# Altium project RadCounterX4.PrjPcb
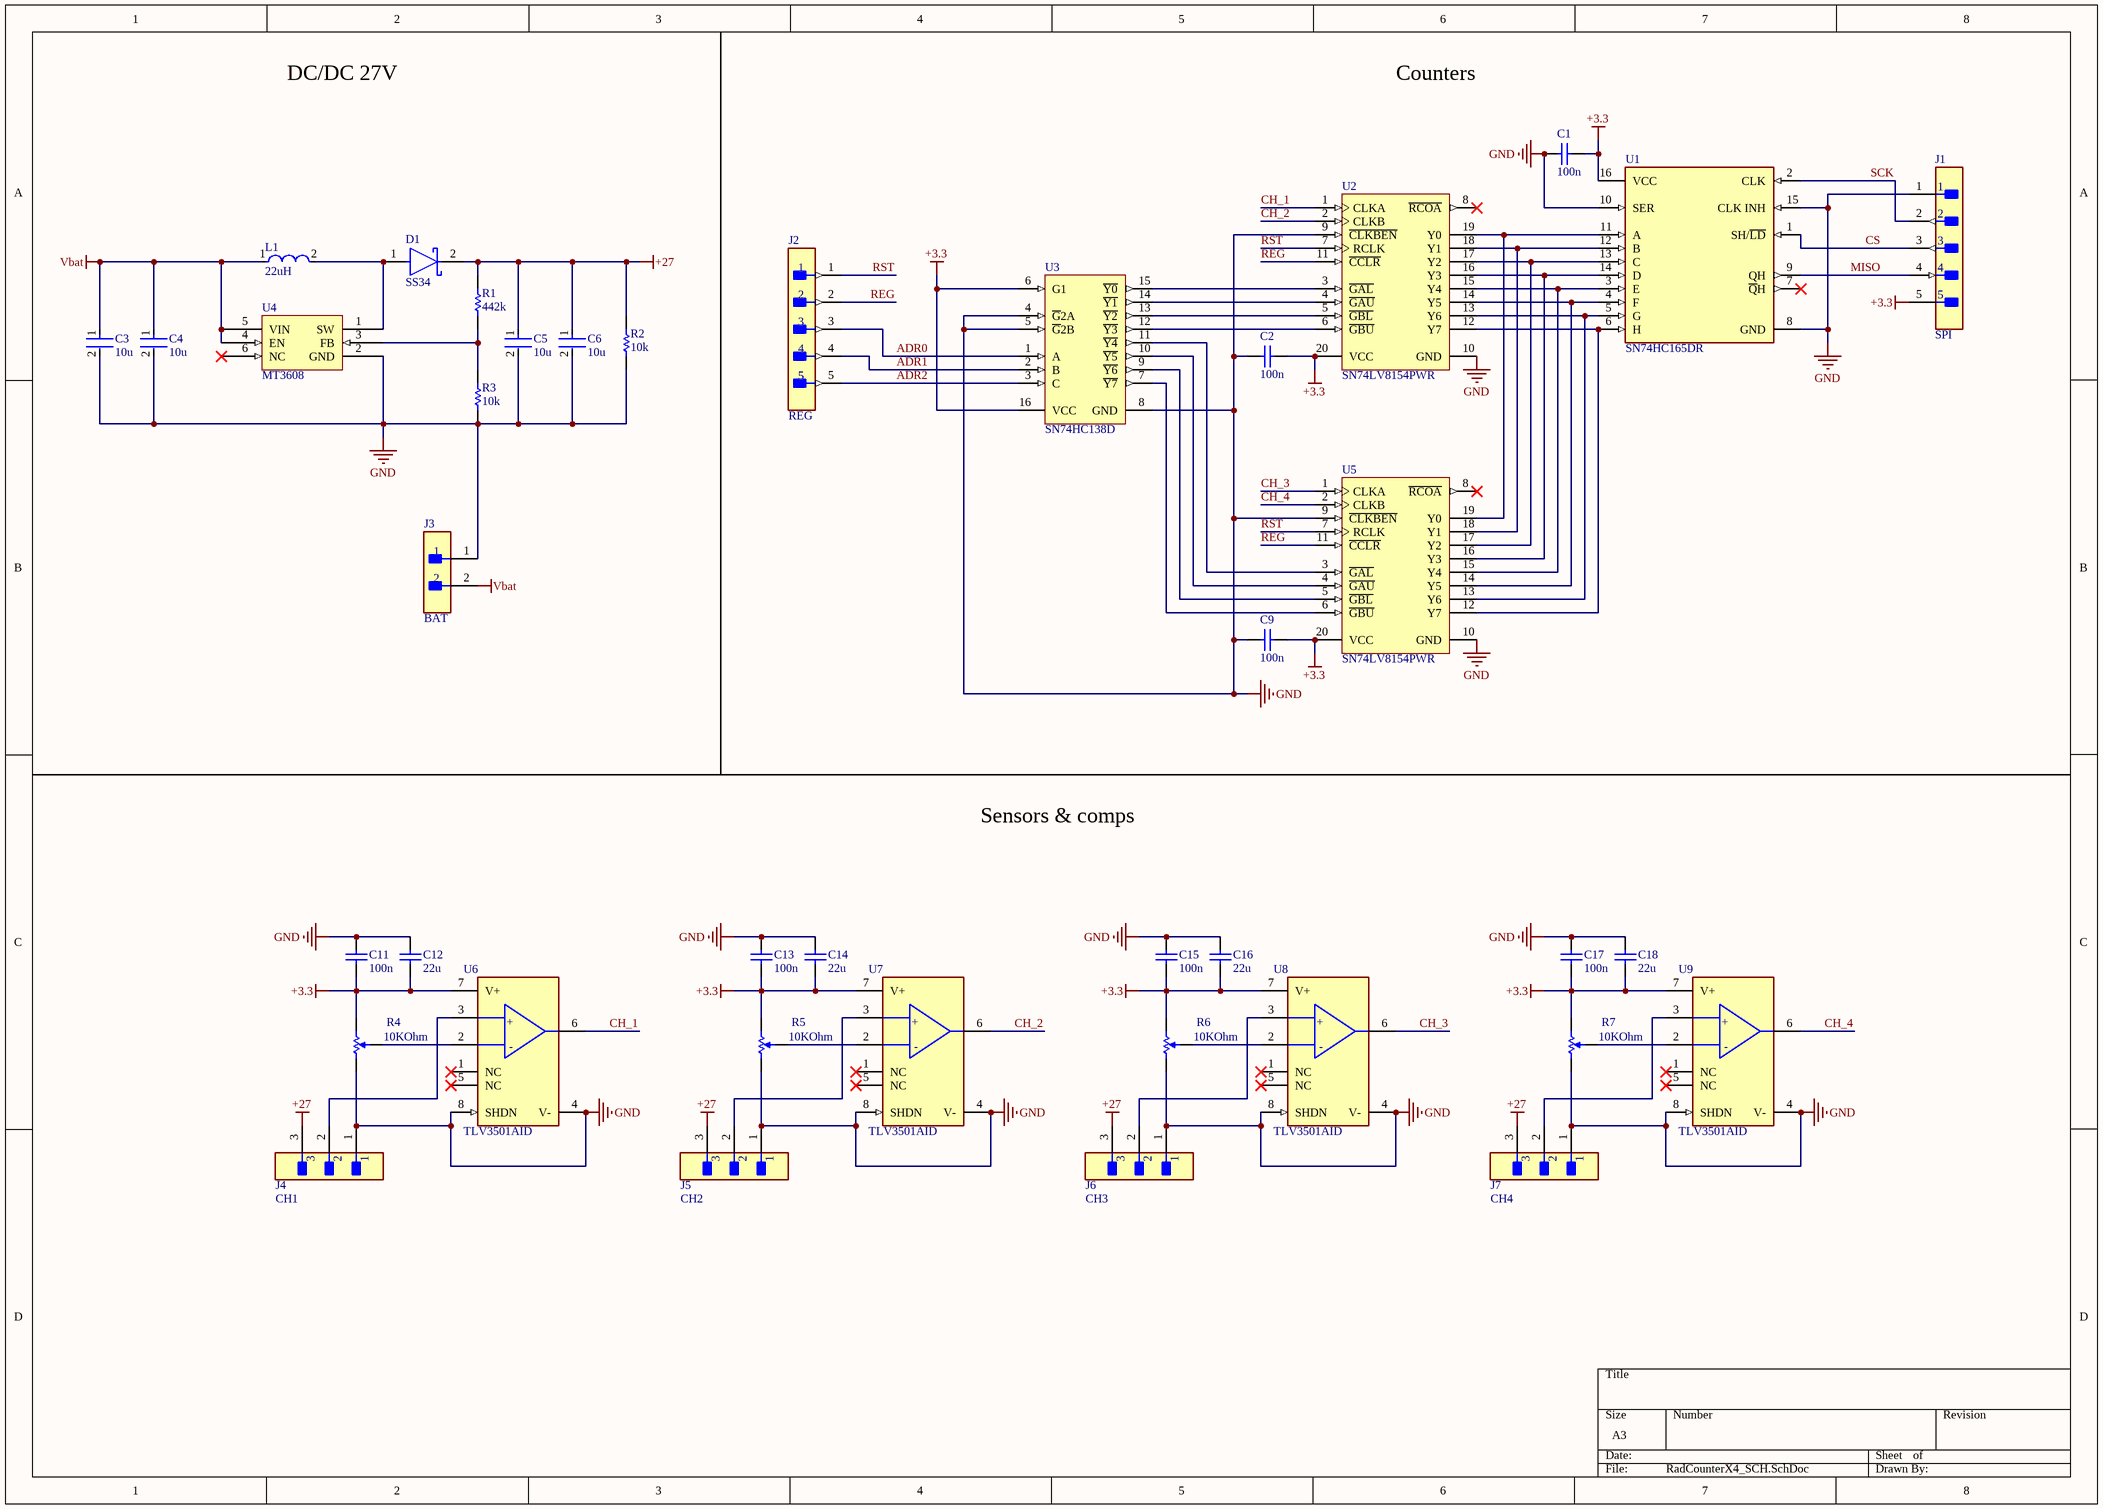
[diagram p0: RadCounterX4_SCH.SchDoc]
1 sheet, 40 parts. Net scope: global (net labels, ports and power ports of the same name join across sheets).
Board file: RadCounterX4_PCB.PcbDoc

## Sheet RadCounterX4_SCH.SchDoc: RadCounterX4
size A3; Author: Nate Hunter; DrawnBy: Nate Hunter; Revision: 1.0; SheetNumber: 1; SheetTotal: 1

### Parts
C1  100n  [C0603]
C2  100n  [C0402]
C3  10u  [FP-GRM32-MFG]
C4  10u  [FP-GRM32-MFG]
C5  10u  [FP-GRM32-MFG]
C6  10u  [FP-GRM32-MFG]
C9  100n  [C0402]
C11  100n  [C0603]
C12  22u  [C0603]
C13  100n  [C0603]
C14  22u  [C0603]
C15  100n  [C0603]
C16  22u  [C0603]
C17  100n  [C0603]
C18  22u  [C0603]
D1  SS34  [FP-403AE-MFG]
J1  SPI  [FP-B5B-XH-AM_LF_SN-MFG]
J2  REG  [FP-B5B-XH-AM_LF_SN-MFG]
J3  BAT  [FP-B2B-XH-A_LF_SN-MFG]
J4  CH1  [FP-B3B-XH-A_LF_SN-MFG]
J5  CH2  [FP-B3B-XH-A_LF_SN-MFG]
J6  CH3  [FP-B3B-XH-A_LF_SN-MFG]
J7  CH4  [FP-B3B-XH-A_LF_SN-MFG]
L1  22uH  [FP-IHLP-2525CZ-FP_2_413x3-MFG]
R1  442k  [R0603]
R2  10k  [R0603]
R3  10k  [R0603]
R4  Resistance: 10KOhm  [BOUR-TC33X-2_V]  (hidden comment: TC33X-2-103E)
R5  Resistance: 10KOhm  [BOUR-TC33X-2_V]  (hidden comment: TC33X-2-103E)
R6  Resistance: 10KOhm  [BOUR-TC33X-2_V]  (hidden comment: TC33X-2-103E)
R7  Resistance: 10KOhm  [BOUR-TC33X-2_V]  (hidden comment: TC33X-2-103E)
U1  SN74HC165DR  [FP-D0016A-MFG]
U2  SN74LV8154PWR  [PW0020A_N]
U3  SN74HC138D  [D0016A_N]
U4  MT3608  [SOT23]
U5  SN74LV8154PWR  [PW0020A_N]
U6  TLV3501AID  [FP-D0008A-IPC_C]
U7  TLV3501AID  [FP-D0008A-IPC_C]
U8  TLV3501AID  [FP-D0008A-IPC_C]
U9  TLV3501AID  [FP-D0008A-IPC_C]

### Nets
+3.3: C1.2 C2.2 C9.2 C11.1 C12.1 C13.1 C14.1 C15.1 C16.1 C17.1 C18.1 J1.5 R4.3 R5.3 R6.3 R7.3 U1.16(VCC) U2.20(VCC) U3.6(G1) U3.16(VCC) U5.20(VCC) U6.7(V+) U7.7(V+) U8.7(V+) U9.7(V+)
+27: C5.1 C6.1 D1.2(C) J4.3 J5.3 J6.3 J7.3 R1.1 R2.2
GND: C1.1 C2.1 C3.2 C4.2 C5.2 C6.2 C9.1 C11.2 C12.2 C13.2 C14.2 C15.2 C16.2 C17.2 C18.2 J1.1 J3.1 J4.1 J5.1 J6.1 J7.1 R2.1 R3.1 R4.1 R5.1 R6.1 R7.1 U1.8(GND) U1.10(SER) U1.15(CLK_INH) U2.9(~{CLKBEN}) U2.10(GND) U3.4(~{G}2A) U3.5(~{G}2B) U3.8(GND) U4.2(GND) U5.9(~{CLKBEN}) U5.10(GND) U6.4(V-) U6.8(SHDN) U7.4(V-) U7.8(SHDN) U8.4(V-) U8.8(SHDN) U9.4(V-) U9.8(SHDN)
Vbat: C3.1 C4.1 J3.2 L1.1 U4.4(EN) U4.5(VIN)
ADR0: J2.3 U3.1(A)
ADR1: J2.4 U3.2(B)
ADR2: J2.5 U3.3(C)
CH_1: U2.1(CLKA) U6.6(OUT)
CH_2: U2.2(CLKB) U7.6(OUT)
CH_3: U5.1(CLKA) U8.6(OUT)
CH_4: U5.2(CLKB) U9.6(OUT)
CS: J1.3 U1.1(SH/~{LD})
MISO: J1.4 U1.9(QH)
REG: J2.2 U2.11(~{CCLR}) U5.11(~{CCLR})
RST: J2.1 U2.7(RCLK) U5.7(RCLK)
SCK: J1.2 U1.2(CLK)
NetD1_1: D1.1(A) L1.2 U4.1(SW)
NetJ4_2: J4.2 U6.3(+IN)
NetJ5_2: J5.2 U7.3(+IN)
NetJ6_2: J6.2 U8.3(+IN)
NetJ7_2: J7.2 U9.3(+IN)
NetR1_2: R1.2 R3.2 U4.3(FB)
NetR4_2: R4.2 U6.2(-IN)
NetR5_2: R5.2 U7.2(-IN)
NetR6_2: R6.2 U8.2(-IN)
NetR7_2: R7.2 U9.2(-IN)
NetU1_3: U1.3(E) U2.15(Y4) U5.15(Y4)
NetU1_4: U1.4(F) U2.14(Y5) U5.14(Y5)
NetU1_5: U1.5(G) U2.13(Y6) U5.13(Y6)
NetU1_6: U1.6(H) U2.12(Y7) U5.12(Y7)
NetU1_11: U1.11(A) U2.19(Y0) U5.19(Y0)
NetU1_12: U1.12(B) U2.18(Y1) U5.18(Y1)
NetU1_13: U1.13(C) U2.17(Y2) U5.17(Y2)
NetU1_14: U1.14(D) U2.16(Y3) U5.16(Y3)
NetU2_3: U2.3(~{GAL}) U3.15(~{Y0})
NetU2_4: U2.4(~{GAU}) U3.14(~{Y1})
NetU2_5: U2.5(~{GBL}) U3.13(~{Y2})
NetU2_6: U2.6(~{GBU}) U3.12(~{Y3})
NetU3_7: U3.7(~{Y7}) U5.6(~{GBU})
NetU3_9: U3.9(~{Y6}) U5.5(~{GBL})
NetU3_10: U3.10(~{Y5}) U5.4(~{GAU})
NetU3_11: U3.11(~{Y4}) U5.3(~{GAL})

Not connected (* = marked no-connect by the designer): U1 7(~{Q}H)*; U2 8(~{RCOA})*; U4 6(NC)*; U5 8(~{RCOA})*; U6 1(NC)* 5(NC)*; U7 1(NC)* 5(NC)*; U8 1(NC)* 5(NC)*; U9 1(NC)* 5(NC)*

### Notes on the sheet
- DC/DC 27V
- Counters
- Sensors & comps
- (in symbol CMP-04896-000133-1) +; -

### Library data of the parts
C1 C2 C9 C11-C18 = Capacitor: Generic SMD Capacitor
  C1 C2 C9 C11 C13 C15 C17: Value: 100n
  C12 C14 C16 C18: Value: 22u
C3-C6 = CMP-2000-05261-2: CAP CER 10UF 50V X7R 1210; Manufacturer Part Number: GRM32ER71H106KA12L; Manufacturer: Murata; Tolerance: 10%; Material: Ceramic; Temperature Coefficient: 15%; Voltage Rating: 50V; Temperature Characteristic: X7R; Value: 10uF; ComponentLink2Description: Datasheet; Device Class L1: Passive Components; Lead Free: Yes; Temperature Range High: +125°C; Category: Cap; ComponentLink2URL: https://search.murata.co.jp/Ceramy/image/img/A01X/G101/ENG/GRM32ER71H106KA12-01.pdf; Device Class L2: Capacitors; Package: GRM32; Mouser Description: 1210 10 uF 50 V ±10% Tolerance X7R SMT Multilayer Ceramic Capacitor; Capacitance: 10uF; Octopart: https://octopart.com/grm32er71h106ka12l-murata-10470987; Digikey Description: CAP CER 10UF 50V X7R 1210; Height: 2.7mm; Temperature: -55°C to +125°C; Temperature Range Low: -55°C; RoHS: TRUE; Device Class L3: Ceramic Capacitors; Automotive: No
D1 = CMP-2000-04943-2: DIODE SCHOTTKY 40V 1A SMA; Manufacturer: ON Semiconductor; Peak Reverse Current: 0.2mA; Max Junction Temp: +125°C; Standoff Height: 0.05mm; Max Surge Forward Current: 40A; Mouser Description: Schottky Diodes & Rectifiers SMA 40V 1.0A; RoHS: TRUE; Lead Free: Yes; Manufacturer Part Number: SS34; Device Class L3: Schottky Diodes; Category: Diode; Automotive: No; Digikey Description: DIODE SCHOTTKY 40V 1A SMA; ComponentLink2Description: Datasheet; Device Class L2: Diodes; Height: 2.5mm; Temperature Range High: +125°C; ComponentLink2URL: https://www.onsemi.com/pub/Collateral/SS19-D.PDF; Device Class L1: Discrete Semiconductors; Package: 403AE; Octopart: https://octopart.com/ss14-on+semiconductor-29205033; Max Repetitive Reverse Voltage: 40V; Temperature Range Low: -65°C; Forward Current: 1A; Temperature: -65°C to +125°C
J1 J2 = CMP-17439-000304-1: CONN HEADER VERT 5POS 2.5MM; Mated Stacking Heights: 9.8mm; Voltage Rating: 250V; Max Current Rating: 3A; Number of Positions: 5; Contact Resistance: 20mR; Depth: 5.75mm; Connector Type: Header; Color: Green; Insulation Material: Nylon; Contact Plating: Copper; Length: 14.9mm; Fastening Type: Detent; Contact Material: Brass; Number of Rows: 1; Contact Type: Male Pin; Housing Material: Polyamide; Housing Color: White; Lead Free: Lead Free; Max Voltage Rating (AC): 250V; Mount: Through Hole; Contact Shape: Square; Min Operating Temperature: -25°C; Packaging: Bulk; Orientation: Straight; Insulation Color: Natural; Series: XH; Flammability Rating: UL94 V-0; Contact Finish - Mating: TIN; Max Operating Temperature: 85°C; Termination: Solder; Pitch: 2.5mm
J3 = CMP-2000-05888-3: CONN HEADER VERT 2POS 2.5MM; Current Rating: 3A; Voltage Rating: 250V; Number of Contacts: 2; Contact Resistance: 20mR; Wire/Cable Gauge: 22AWG; Insulation Resistance: 1GR; Connector Type: Male Pin; Packaging: Bulk; Contact Material: Brass; Lead Free: Lead Free; Orientation: Straight; Contact Plating: Tin; Max Current Rating: 3A; Termination: Solder; Fastening Type: Detent; Depth: 5.75mm; Housing Material: Polyamide; REACH SVHC: No SVHC; Series: XH; Voltage Rating (AC): 250V; Number of Positions: 2; Color: Natural; Contact Type: Male Pin; Max Voltage Rating (DC): 250V; Pitch: 2.5mm; Lead Pitch: 2.5mm; Mount: Through Hole; Max Operating Temperature: 85°C; Length: 7.4mm; Max Voltage Rating (AC): 250V; Min Operating Temperature: -25°C; Number of Rows: 1; Housing Color: White
J4-J7 = CMP-17439-000014-3: CONN HEADER VERT 3POS 2.5MM; Max Voltage Rating (DC): 250V; Number of Positions: 3; Current Rating: 3A; Gender: Male; Wire/Cable Gauge: 22AWG; Contact Resistance: 20mR; Insulation Resistance: 1GR; Insulation Material: Nylon; Contact Plating: Tin; Depth: 5.75mm; Contact Type: Male Pin; Max Operating Temperature: 85°C; Insulation Color: Natural; Voltage Rating (AC): 250V; Color: Natural; Connector Type: Header; Orientation: Straight; Fastening Type: Detent; Housing Color: White; Min Operating Temperature: -25°C; Termination: Solder; Voltage Rating: 250V; Series: XH; Pitch: 2.5mm; Contact Shape: Square; Number of Rows: 1; Lead Free: Lead Free; Packaging: Bulk; Mount: Through Hole; Flammability Rating: UL94 V-0; Max Voltage Rating (AC): 250V; REACH SVHC: No SVHC; Housing Material: Polyamide; Contact Material: Brass; Lead Pitch: 2.5mm; Contact Finish - Mating: TIN; Length: 9.9mm; Max Current Rating: 3A; Number of Contacts: 3
L1 = CMP-2000-06442-2: Commercial Inductors, Low DCR Series 22uH 2.9A 135mΩ 20%; Self Resonant Frequency: 1MHz; Shielding: Shielded; Core Material: Ferrite; DC Resistance (DCR): 135mR; Test Frequency: 100kHz; Saturation Current: 2.5A; Case/Package: 2525; Inductance Tolerance: 20%; Max DC Current: 2.9A; Inductance: 22uH; Termination: SMD/SMT; Case Code (Imperial): 2525; Mount: Surface Mount; Military Standard: Not; Min Operating Temperature: -55°C; RMS Current (Irms): 2.9A; Package Quantity: 2000; Max Operating Temperature: 125°C; Length: 7.24mm; Depth: 6.72mm; Packaging: Tape and Reel; Height: 3mm; Width: 0.255inch; Lead Free: Lead Free; Tolerance: 20%; Contact Plating: Tin; Current Rating: 2.9A; Number of Pins: 2; Case Code (Metric): 6363; Radiation Hardening: No; Height - Seated (Max): 0.118inch
R1-R3 = Resistor: Generic SMD Resistor
  R1: Value: 442k
  R2 R3: Value: 10k
R4-R7 = CMP-2100-03695-1: Trimming Potentiometer, 10000 Ohm, -40 to 100 degC, 3-Pin SMD, RoHS, Tape and Reel; Manufacturer: Bourns; Tolerance: 25%; Max Power Dissipation: 100mW; Number of Turns: 1; Temperature Coefficient: 250ppm/degreesC; Voltage Rating (DC): 50V; Datasheet URL: http://www.bourns.com/docs/Product-Datasheets/TC33.pdf; Composition: Potentiometer; Package Description: 3-Pin Surface Mount Device, Body 3.8 x 3.6 mm; Weight: 29.4mg; Power Rating: 100mW; Termination: FootPrint; Manufacturer URL: http://www.bourns.com/; Width: 0.118inch; Height: 0.047inch; Military Standard: Not; Radiation Hardening: No; Colour: Silver; Case/Package: SMD/SMT; Depth: 3.8mm; Min Operating Temperature: -40degC; Lead Free: LeadFree; Datasheet Version: 42583.0; REACH SVHC: NoSVHC; Length: 3mm; RoHSCompliant: true; Contact Plating: Silver; Taper: Linear; Packaging: TapeandReel; Mount: SurfaceMount; Max Operating Temperature: 100degC; Package Reference: TC33X-2; Package Quantity: 2500
U1 = CMP-0780-00020-4: IC 8-BIT SHIFT REGISTER 16-SOIC; Manufacturer: Texas Instruments; Propagation Delay: 13ns; Min Supply Voltage: 2V; Number Of Circuits: 1; Nominal Supply Current: 8uA; Logic Function Desc: Non-Inverting; Number Of Inputs: 8; Max Supply Voltage: 6V; Standoff Height: 0.1mm; Frequency: 62MHz; Mouser Description: Counter Shift Registers 8-Bit Parallel-Load; ComponentLink2Description: Datasheet; Number Of Outputs: 1; Temperature Range Low: -40°C; Manufacturer Part Number: SN74HC165DR; Device Class L1: Integrated Circuits (ICs); Octopart: https://octopart.com/sn74hc165dr-texas+instruments-500689; Ambient Temperature Range Low: -40°C; Temperature Range High: +125°C; Lead Free: Yes; Package: D0016A; Height: 1.75mm; Device Class L3: Shift Registers; Ambient Temperature Range High: +125°C; Device Class L2: Logic ICs; ComponentLink2URL: https://www.ti.com/lit/ds/symlink/sn74hc165.pdf; Automotive: No; Digikey Description: IC 8-BIT SHIFT REGISTER 16-SOIC; Category: IC; Temperature: -40°C to +125°C; RoHS: TRUE
U2 U5 = CMP-1623-00713-2: Dual 16-Bit Binary Counters with 3-State Output Registers, PW0020A, LARGE T&R; Manufacturer: Texas Instruments; Inputs: 1; Technology Family: LV-A; tpd @ Nom Voltage(Max)(ns): 27; ICC @ Nom Voltage(Max)(mA): 0.02; F @ Nom Voltage(Max)(Mhz): 40; Output Drive (IOL/IOH)(Max)(mA): 12/-12; Input Type: CMOS; Rating: Catalog; VCC(Min)(V): 2; Voltage(Nom)(V): 2.5,3.3,5; Schmitt Trigger: No; VCC(Max)(V): 5.5; Bits(#): 16; PackageReference: PW0020A; Code_JEDEC: MO-153; Generic Part Number: SN74LV8154; DatasheetVersion: SCLS589; Type: Binary; Operating Temperature Range(C): -40 to 85; Function: Counter; Output Type: CMOS
U3 = CMP-1633-00243-2: 3-Line To 8-Line Decoders/Demultiplexers, D0016A, TUBE; Manufacturer: Texas Instruments; Technology Family: HC; Function: Decoder/Demultiplexer; VCC(Max)(V): 6; Output Drive (IOL/IOH)(Max)(mA): 5.2/-5.2; Voltage(Nom)(V): 3.3,5; VCC(Min)(V): 2; Input Type: LVTTL/CMOS; Rating: Catalog; ICC @ Nom Voltage(Max)(mA): 0.08; Configuration: 3：8; Bits(#): 8; Channels(#): 1; tpd @ Nom Voltage(Max)(ns): 45; F @ Nom Voltage(Max)(Mhz): 28; Schmitt Trigger: No; Output Type: CMOS; Type: Standard; Operating Temperature Range(C): -40 to 85; Generic Part Number: SN74HC138; Code_JEDEC: MS-012 variation AC; DatasheetVersion: SCLS107E; PackageReference: D0016A
U4 = MT3608: 2A, High Efficiency 1.2MHz Current Mode Step-Up Converter
U6-U9 = CMP-04896-000133-1: IC COMPARATOR 4.5NS R-R HS 8SOIC; Max Supply Voltage: 5.5V; Operating Supply Current: 5mA; Input Offset Voltage (Vos): 6.5mV; Common Mode Rejection Ratio: 70dB; Propagation Delay: 10ns; Number of Elements: 1; Hysteresis: 6mV; Min Supply Voltage: 2.7V; Input Bias Current: 10pA; Supply Type: Single; Nominal Supply Current: 3.2mA; Output Type: TTL; Power Supply Rejection Ratio (PSRR): 100dB; Output Current: 74mA; Min Operating Temperature: -40°C; Lead Free: Lead Free; Weight: 0.002677oz; Number of Pins: 8; Length: 4.9mm; RoHS Compliant: Yes; Case/Package: SOIC; Quiescent Current: 5mA; Package Quantity: 75; Response Time: 4.5ns; Max Operating Temperature: 125°C; Width: 3.91mm; Radiation Hardening: No; Packaging: Rail/Tube; Mount: Surface Mount; Type: General Purpose; REACH SVHC: No SVHC; Height: 1.58mm; Number of Channels: 1